# EasyEDA Pro project F405飞控工程文件（20250418）.epro, board 扩展30.5
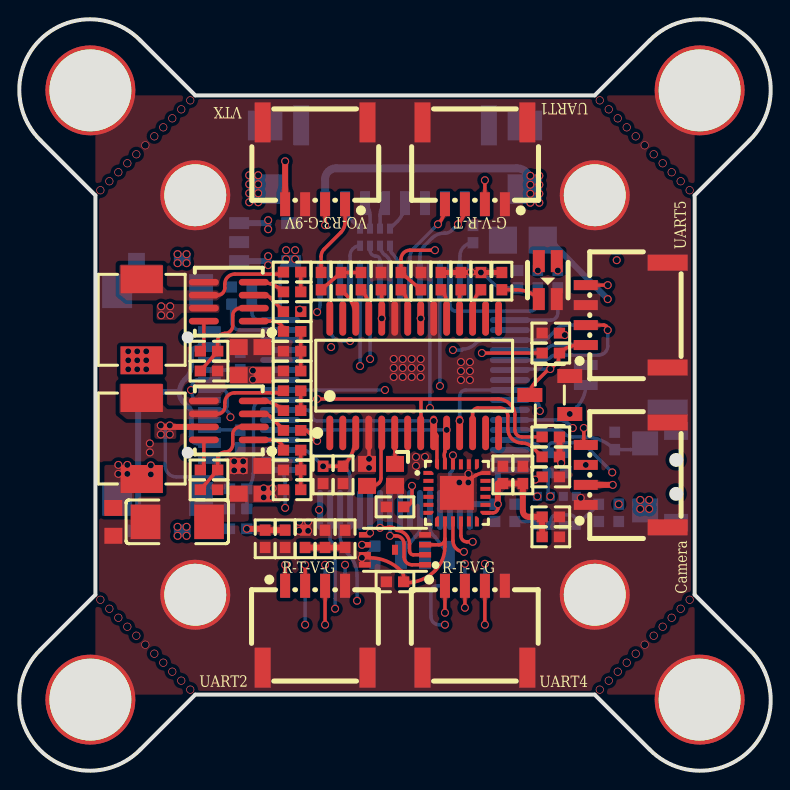
[diagram p5: board, top side]
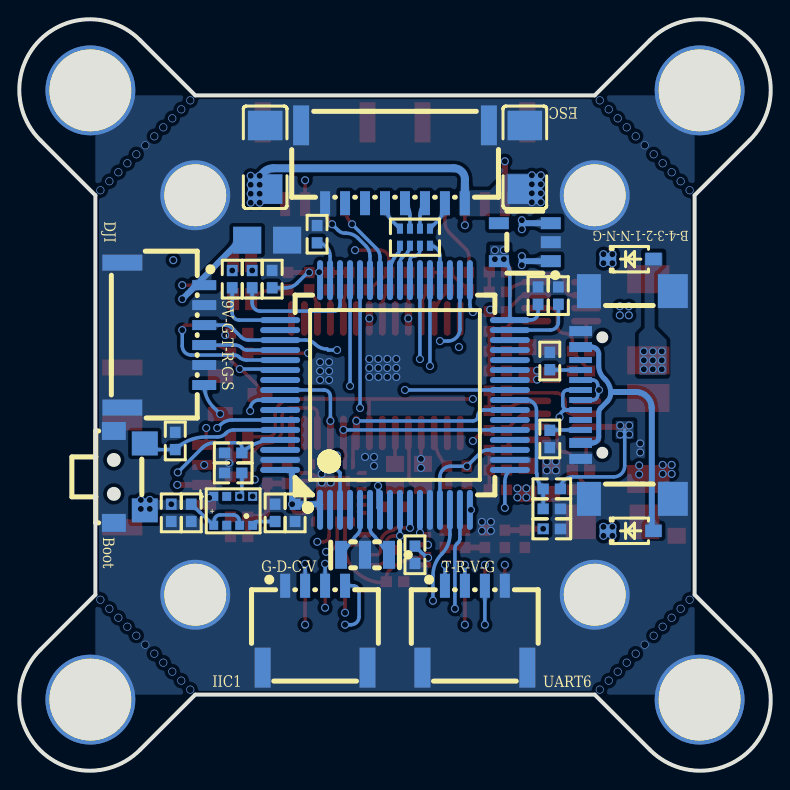
[diagram p6: board, bottom side, seen from below]

Outline 37.62 x 37.62 mm; copper layers: Top Layer, Inner1, Inner2, Bottom Layer. Coordinates in mm from the lower left corner of the outline.
Outline path: 1.06,31.56 arc(1.04,36.59) 6.06,36.56 8.81,33.81 28.81,33.81 31.56,36.56 arc(36.59,36.59) 36.56,31.56 33.81,28.82 33.81,8.81 36.56,6.06 arc(36.59,1.04) 31.56,1.06 28.81,3.81 8.81,3.81 6.06,1.06 arc(1.04,1.04) 1.06,6.06 3.81,8.81 3.81,28.81 1.06,31.56
Stack: Top Layer 0.035mm 外层铜厚1oz / Dielectric1 0.2104mm 7628 RC49% 8.6mil / Inner1 0.0152mm 内层铜厚 / Dielectric2 1.065mm 1.1mm H/HOZ Copper / Inner2 0.0152mm 内层铜厚 / Dielectric3 0.2104mm 7628 RC49% 8.6mil / Bottom Layer 0.035mm 外层铜厚1oz

## Design rules (mm)
template: 自定义配置
spacing copperThickness1oz (default): track to track 0.102, other pairs 0 to 0.3
spacing copperThickness2oz: track to track 0.203, other pairs 0.152 to 0.3
track width copperThickness1oz (default): min 0.127, default 0.175, max 2.54
track width copperThickness2oz: min 0.203, default 0.254, max 2.54
differential pair differentialPair (default): width min 0.127, default 0.254, max 2.54; gap min 0.152, default 0.152
via viaSize (default): diameter min 0.4, default 0.4, max 10; hole min 0.3, default 0.3, max 6.3

## Placement (name value [footprint] x y rotation side)
C1  100nF  [R0402]  24.96 24.61 90 bottom
C2  100nF  [R0402]  23.81 12.91 270 bottom
C3  100nF  [R0402]  11.65 23.79 90 bottom
C4  100nF  [R0402]  17.81 10.81 270 bottom
C5  100nF  [R0402]  25.21 14.81 90 top
C6  1uF  [R0402]  24.21 14.81 90 top
C7  100nF  [R0402]  26.61 21.91 0 top
C8  2.2uF  [R0402]  10.96 12.11 0 bottom
C11  100nF  [R0402]  18.81 13.21 180 top
C12  100nF  [C0402]  9.5 20.02 180 top
C13  100nF  [C0402]  9.5 14.07 180 top
C14  22uF  [C0603]  12.18 20.51 270 top
C15  22uF  [C0603]  10.99 20.51 270 top
C16  22uF  [C0603]  10.99 14.57 270 top
C18  47uF  [C1206]  25.31 30.71 270 bottom
C19  47uF  [C1206]  12.31 30.71 270 bottom
C20  100nF  [C0402]  13.66 23.98 0 top
C21  100nF  [C0402]  13.66 18.03 0 top
C22  2.2uF  [R0402]  10.64 23.79 90 bottom
C23  2.2uF  [R0402]  22.71 26.86 90 bottom
C25  47uF  [C1206]  7.91 12.46 0 top
C26  100nF  [C0402]  30.01 12.91 90 bottom
C27  100nF  [C0402]  29.01 12.91 90 bottom
C29  100nF  [C0402]  26.61 14.71 180 top
C30  4.7uF  [C0603]  4.71 12.46 270 top
C32  100nF  [C0402]  18.11 24.51 90 top
C33  100nF  [C0402]  15.21 14.81 270 top
C34  100nF  [C0402]  16.21 14.81 270 top
C35  22uF  [C0805]  25.21 26.56 0 bottom
C36  100nF  [C0402]  15.31 11.61 270 top
C37  10nF  [C0402]  16.31 11.61 270 top
C38  22uF  [C0402]  16.11 24.51 90 top
C39  22uF  [C0402]  17.11 24.51 90 top
C41  100nF  [C0402]  19.11 24.51 90 top
C42  22uF  [C0603]  12.18 14.57 270 top
C43  100nF  [R0402]  18.81 9.46 180 top
C44  100nF  [R0402]  12.31 11.61 270 top
C45  100nF  [R0402]  14.31 11.61 90 top
C46  100nF  [R0402]  13.31 11.61 270 top
C47  100nF  [R0402]  26.61 12.71 0 top
C48  100nF  [R0402]  26.61 11.71 0 top
CN1  HDGC1002WR-S-4P  [CONN-SMD_4P-P1.00_HDGC_HDGC1002WR-S-4P]  22.81 30.41 180 top
CN2  HDGC1002WR-S-4P  [CONN-SMD_4P-P1.00_HDGC_HDGC1002WR-S-4P]  14.81 30.41 180 top
CN3  HDGC1002WR-S-4P  [CONN-SMD_4P-P1.00_HDGC_HDGC1002WR-S-4P]  14.81 7.21 0 top
CN4  HDGC1002WR-S-4P  [CONN-SMD_4P-P1.00_HDGC_HDGC1002WR-S-4P]  30.41 14.81 90 top
CN6  HDGC1002WR-S-4P  [CONN-SMD_4P-P1.00_HDGC_HDGC1002WR-S-4P]  22.81 7.21 0 top
CN7  HDGC1002WR-S-4P  [CONN-SMD_4P-P1.00_HDGC_HDGC1002WR-S-4P]  30.41 22.81 90 top
CN8  HDGC1002WR-S-4P  [CONN-SMD_4P-P1.00_HDGC_HDGC1002WR-S-4P]  22.81 7.21 180 bottom
CN9  HDGC1002WR-S-6P  [CONN-SMD_6P-P1.00_HDGC1002WR-S-6P]  30.41 21.81 270 bottom
CN10  HDGC1002WR-S-4P  [CONN-SMD_4P-P1.00_HDGC_HDGC1002WR-S-4P]  14.81 7.21 180 bottom
D1  BAT60B  [SOD-323_L1.7-W1.3-LS2.6-RD-1]  7.01 25.61 180 bottom
D2  BAT60B  [SOD-323_L1.7-W1.3-LS2.6-RD-1]  7.01 12.01 180 bottom
L1  10uH  [IND-SMD_L4.4-W4.2]  6.13 22.58 90 top
L2  10uH  [IND-SMD_L4.4-W4.2]  6.13 16.64 90 top
LED1  TJ-S1615CY6TGLCCSRGB-A5  [LED-ARRAY-SMD_4P-L1.6-W1.5-BL-FD]  26.46 24.56 90 top
NOREF  -  [Pad_e2430]  34.06 3.56 0 top
NOREF#2  -  [Pad_e186]  28.81 8.81 0 top
NOREF#3  -  [Pad_e2431]  3.56 3.56 0 top
NOREF#4  -  [Pad_e2428]  3.56 34.06 0 top
NOREF#5  -  [Pad_e2429]  34.06 34.06 0 top
NOREF#6  -  [Pad_e187]  8.81 8.81 0 top
NOREF#7  -  [Pad_e183]  28.81 28.81 0 top
NOREF#8  -  [Pad_e188]  8.81 28.81 0 top
Q1  SS8050_C2150  [SOT-23-3_L2.9-W1.3-P1.90-LS2.4-BR]  26.56 18.81 0 top
R1  10kΩ  [R0402]  29.81 16.51 90 bottom
R2  10kΩ  [R0402]  10.96 14.11 180 bottom
R3  1kΩ  [R0402]  10.96 13.11 0 bottom
R4  100kΩ  [R0402]  9.5 21.01 180 top
R5  100kΩ  [R0402]  9.5 15.06 180 top
R6  10kΩ  [R0402]  26.61 20.91 0 top
R7  1MΩ  [R0402]  13.66 22.99 180 top
R8  1MΩ  [R0402]  13.66 17.04 180 top
R9  20Ω  [R0402]  13.66 24.97 0 top
R10  20Ω  [R0402]  13.66 19.02 0 top
R11  1kΩ  [R0402]  25.96 24.61 90 bottom
R12  10kΩ  [R0402]  26.91 15.91 180 bottom
R13  10kΩ  [R0402]  26.91 14.91 180 bottom
R14  1kΩ  [R0402]  26.96 24.61 90 bottom
R15  1kΩ  [R0402]  24.16 24.51 270 top
R16  51kΩ  [R0402]  13.66 22 0 top
R17  41.2kΩ  [R0402]  13.66 20.02 180 top
R18  51kΩ  [R0402]  13.66 16.05 0 top
R19  41.2kΩ  [R0402]  13.66 14.07 180 top
R20  7.68kΩ  [R0402]  13.66 21.01 0 top
R21  4.02kΩ  [R0402]  13.66 15.06 0 top
R22  100kΩ  [R0402]  24.81 12.91 270 bottom
R23  5.1kΩ  [R0402]  11.06 20.51 270 bottom
R24  5.1kΩ  [R0402]  11.06 16.61 90 bottom
R25  1k  [R0402]  26.61 15.71 0 top
R26  1k  [R0402]  22.11 24.51 90 top
R27  1k  [R0402]  23.11 24.51 90 top
R28  10k  [R0402]  21.11 24.51 90 top
R29  10k  [R0402]  26.61 16.71 0 top
R30  75  [R0402]  15.11 24.51 90 top
R34  75  [R0402]  20.11 24.51 90 top
RN2  47Ω  [RES-ARRAY-SMD_0402-8P-L2.0-W1.0-BL]  17.81 26.71 180 bottom
SW1  TS24CA  [SW-SMD_TS24CA]  32.11 14.71 90 bottom
U1  ME6217C33M5G  [SOT-23-5_L3.0-W1.7-P0.95-LS2.8-BR]  12.31 26.46 180 bottom
U2  MP9943GQ-Z  [QFN-8_L3.0-W3.0-P0.65-BL]  10.49 23.49 90 top
U3  MP9943GQ-Z  [QFN-8_L3.0-W3.0-P0.65-BL]  10.49 17.54 90 top
U4  AT7456E  [AT7456E-SHORTER-FOOTPRINT]  19.77 19.78 0 top
U5  MPU6500  [QFN-24_L3.0-W3.0-P0.40-BL-EP]  21.91 13.91 270 top
U6  SPL06-001  [SENSOR-SMD_SPL06-001]  26.91 13.01 0 bottom
U8  HDGC1002WR-S-8P  [CONN-SMD_8P-P1.00_HDGC_HDGC1002WR-S-8P]  18.81 30.37 0 bottom
U9  Crystal2016  [CRYSTAL2016]  18.11 14.81 0 top
U10  STM32F405RGT6  [LQFP-64_L10.0-W10.0-P0.50-LS12.0-BL]  18.81 18.81 180 bottom
U11  W25Q16JVUXIQ  [USON-8_L3.0-W2.0-P0.50-BL-EP]  18.81 11.06 90 top
USB1  TYPE-C 16P QTWT  [USB-TYPE-C-SMD_TYPE-C-16P-QTWT]  7.21 18.81 90 bottom
X1  8MHz  [OSC-SMD_3P-L3.2-W1.3-P1.20-L]  20.31 10.81 0 bottom

## Footprints (pads in the part's own frame, mm; a bottom-side part is the same pattern mirrored in y, then rotated)
AT7456E-SHORTER-FOOTPRINT
  oval 0.343x1.732 smd: 1(-4.225,-2.866) 2(-3.575,-2.866) 3(-2.925,-2.866) 4(-2.275,-2.866) 5(-1.625,-2.866) 6(-0.975,-2.866) 7(-0.325,-2.866) 8(0.325,-2.866) 9(0.975,-2.866) 10(1.625,-2.866) 11(2.275,-2.866) 12(2.925,-2.866) 13(3.575,-2.866) 14(4.225,-2.866) 15(4.225,2.865) 16(3.575,2.865) 17(2.925,2.865) 18(2.275,2.865) 19(1.625,2.865) 20(0.975,2.865) 21(0.325,2.865) 22(-0.325,2.865) 23(-0.975,2.865) 24(-1.625,2.865) 25(-2.275,2.865) 26(-2.925,2.865) 27(-3.575,2.865) 28(-4.225,2.865)
C0402
  rect 0.567x0.54 smd: 1(-0.432,0) 2(0.432,0)
C0603
  rect 0.8x0.9 smd: 1(-0.7,0) 2(0.7,0)
C0805
  rect 1.41x1.35 smd: 1(-1,0) 2(1,0)
C1206
  rect 1.485x1.728 smd: 1(-1.593,0) 2(1.593,0)
CONN-SMD_4P-P1.00_HDGC_HDGC1002WR-S-4P
  rect 0.5x1.2 smd: 1(-1.5,2.05) 2(-0.5,2.05) 3(0.5,2.05) 4(1.5,2.05)
  rect 0.8x2 smd: 5(2.625,-2.05) 6(-2.625,-2.05)
CONN-SMD_6P-P1.00_HDGC1002WR-S-6P
  rect 0.5x1.2 smd: 1(-2.5,2.05) 2(-1.5,2.05) 3(-0.5,2.05) 4(0.5,2.05) 5(1.5,2.05) 6(2.5,2.05)
  rect 0.8x2 smd: 7(3.625,-2.05) 8(-3.625,-2.05)
CONN-SMD_8P-P1.00_HDGC_HDGC1002WR-S-8P
  rect 0.5x1.2 smd: 1(-3.5,1.95) 2(-2.5,1.95) 3(-1.5,1.95) 4(-0.5,1.95) 5(0.5,1.95) 6(1.5,1.95) 7(2.5,1.95) 8(3.5,1.95)
  rect 0.8x2 smd: 9(4.7,-1.95) 10(-4.7,-1.95)
CRYSTAL2016
  custom 0.9x0.8 smd: 1(0.7,0.55) 2(-0.7,0.55) 3(-0.7,-0.55) 4(0.7,-0.55)
IND-SMD_L4.4-W4.2
  rect 1.4x2.12 smd: 1(2.028,0) 2(-2.028,0)
LED-ARRAY-SMD_4P-L1.6-W1.5-BL-FD
  rect 1.1x0.6 smd: 1(-0.95,-0.45) 2(0.95,-0.45) 3(0.95,0.45) 4(-0.95,0.45)
LQFP-64_L10.0-W10.0-P0.50-LS12.0-BL
  oval 0.3x2 smd: 1(-3.75,-5.75) 2(-3.25,-5.75) 3(-2.75,-5.75) 4(-2.25,-5.75) 5(-1.75,-5.75) 6(-1.25,-5.75) 7(-0.75,-5.75) 8(-0.25,-5.75) 9(0.25,-5.75) 10(0.75,-5.75) 11(1.25,-5.75) 12(1.75,-5.75) 13(2.25,-5.75) 14(2.75,-5.75) 15(3.25,-5.75) 16(3.75,-5.75) 33(3.75,5.75) 34(3.25,5.75) 35(2.75,5.75) 36(2.25,5.75) 37(1.75,5.75) 38(1.25,5.75) 39(0.75,5.75) 40(0.25,5.75) 41(-0.25,5.75) 42(-0.75,5.75) 43(-1.25,5.75) 44(-1.75,5.75) 45(-2.25,5.75) 46(-2.75,5.75) 47(-3.25,5.75) 48(-3.75,5.75)
  oval 2x0.3 smd: 17(5.75,-3.75) 18(5.75,-3.25) 19(5.75,-2.75) 20(5.75,-2.25) 21(5.75,-1.75) 22(5.75,-1.25) 23(5.75,-0.75) 24(5.75,-0.25) 25(5.75,0.25) 26(5.75,0.75) 27(5.75,1.25) 28(5.75,1.75) 29(5.75,2.25) 30(5.75,2.75) 31(5.75,3.25) 32(5.75,3.75) 49(-5.75,3.75) 50(-5.75,3.25) 51(-5.75,2.75) 52(-5.75,2.25) 53(-5.75,1.75) 54(-5.75,1.25) 55(-5.75,0.75) 56(-5.75,0.25) 57(-5.75,-0.25) 58(-5.75,-0.75) 59(-5.75,-1.25) 60(-5.75,-1.75) 61(-5.75,-2.25) 62(-5.75,-2.75) 63(-5.75,-3.25) 64(-5.75,-3.75)
OSC-SMD_3P-L3.2-W1.3-P1.20-L
  rect 0.6x1.4 smd: 1(-1.199,0) 2(0,0) 3(1.199,0)
Pad_e183
  round 3.5 hole 3.1: 1(0,0)
Pad_e186
  round 3.5 hole 3.1: 1(0,0)
Pad_e187
  round 3.5 hole 3.1: 1(0,0)
Pad_e188
  round 3.5 hole 3.1: 1(0,0)
Pad_e2428
  round 4.5 hole 4.1: 1(0,0)
Pad_e2429
  round 4.5 hole 4.1: 1(0,0)
Pad_e2430
  round 4.5 hole 4.1: 1(0,0)
Pad_e2431
  round 4.5 hole 4.1: 1(0,0)
QFN-8_L3.0-W3.0-P0.65-BL
  oval 0.33x1.5 smd: 1(-0.975,-1.25) 2(-0.325,-1.25) 3(0.325,-1.25) 4(0.975,-1.25) 5(0.975,1.25) 6(0.325,1.25) 7(-0.325,1.25) 8(-0.975,1.25)
QFN-24_L3.0-W3.0-P0.40-BL-EP
  custom 0.2x0.506 smd: 1(-1,-1.427) 6(1,-1.427) 13(1,1.427) 18(-1,1.427)
  rect 0.2x0.505 smd: 2(-0.6,-1.427) 3(-0.2,-1.427) 4(0.2,-1.427) 5(0.6,-1.427) 14(0.6,1.427) 15(0.2,1.427) 16(-0.2,1.427) 17(-0.6,1.427)
  custom 0.506x0.2 smd: 7(1.427,-1) 12(1.427,1) 19(-1.427,1) 24(-1.427,-1)
  rect 0.505x0.2 smd: 8(1.427,-0.6) 9(1.427,-0.2) 10(1.427,0.2) 11(1.427,0.6) 20(-1.427,0.6) 21(-1.427,0.2) 22(-1.427,-0.2) 23(-1.427,-0.6)
  rect 1.7x1.7 smd: 25(0,0)
R0402
  rect 0.566x0.54 smd: 1(-0.433,0) 2(0.433,0)
RES-ARRAY-SMD_0402-8P-L2.0-W1.0-BL
  rect 0.3x0.505 smd: 1(-0.75,0.427) 2(-0.25,0.427) 3(0.25,0.427) 4(0.75,0.427) 5(0.75,-0.427) 6(0.25,-0.427) 7(-0.25,-0.427) 8(-0.75,-0.427)
SENSOR-SMD_SPL06-001
  rect 0.45x0.45 smd: 1(0.975,-0.725) 2(0.325,-0.725) 3(-0.325,-0.725) 4(-0.975,-0.725) 5(-0.975,0.725) 6(-0.325,0.725) 7(0.325,0.725) 8(0.975,0.725)
SOD-323_L1.7-W1.3-LS2.6-RD-1
  rect 0.83x0.63 smd: 1(-1.14,0) 2(1.14,0)
SOT-23-3_L2.9-W1.3-P1.90-LS2.4-BR
  rect 1.25x0.7 smd: 1(1,-0.95) 2(1,0.95) 3(-1,0)
SOT-23-5_L3.0-W1.7-P0.95-LS2.8-BR
  rect 1x0.6 smd: 1(1.3,-0.95) 2(1.3,0) 3(1.3,0.95) 4(-1.3,0.95) 5(-1.3,-0.95)
SW-SMD_TS24CA
  rect 0.9x1.2 smd: 1(-2.3,0.775) 2(2.3,0.775)
  rect 1.2x1.3 smd: 3(-1.675,-0.775) 4(1.675,-0.775)
USB-TYPE-C-SMD_TYPE-C-16P-QTWT
  rect 1.7x1.5 smd: 0(-5.2,-2.309) 0(5.2,-2.309)
  rect 1.7x1.2 smd: 0(-5.2,1.891) 0(5.2,1.891)
  rect 0.5x1.14 smd: A1(-3.2,2.308) A4(-2.4,2.308) A9(2.4,2.308) A12(3.2,2.308)
  rect 0.3x1.14 smd: A5(-1.25,2.308) A6(-0.25,2.308) A7(0.25,2.308) A8(1.25,2.309) B5(1.75,2.308) B6(0.75,2.308) B7(-0.75,2.308) B8(-1.75,2.309)
USON-8_L3.0-W2.0-P0.50-BL-EP
  rect 0.28x0.6 smd: 1(-0.75,-1.508) 2(-0.25,-1.508) 3(0.25,-1.508) 4(0.75,-1.508) 5(0.75,1.508) 6(0.25,1.508) 7(-0.25,1.508) 8(-0.75,1.508)
  rect 0.5x0.3 smd: 9(0,0)

## Nets
As in the schematic, except:
GND: C1.2 C2.2 C3.2 C4.2 C5.2 C6.2 C7.1 C8.1 C11.2 C12.1 C13.1 C14.1 C15.1 C16.1 C18.1 C19.1 C22.2 C23.2 C25.1 C26.1 C27.1 C29.1 C30.2 C32.2 C33.2 C34.2 C35.1 C36.1 C37.1 C42.1 C43.2 C44.2 C45.2 C46.2 C47.2 C48.2 CN1.1 CN1.5 CN1.6 CN2.3 CN2.5 CN2.6 CN3.4 CN3.5 CN3.6 CN4.1 CN4.5 CN4.6 CN6.4 CN6.5 CN6.6 CN7.3 CN7.5 CN7.6 CN8.1 CN8.5 CN8.6 CN9.2 CN9.5 CN9.7 CN9.8 CN10.4 CN10.5 CN10.6 LED1.1 NOREF.1 NOREF#2.1 NOREF#3.1 NOREF#4.1 NOREF#5.1 NOREF#6.1 NOREF#7.1 NOREF#8.1 Q1.2 R1.2 R3.1 R20.1 R21.1 R22.1 R23.1 R24.1 R34.2 SW1.1 SW1.2 U1.2 U2.5 U3.5 U4.4 U4.20 U4.23 U5.18 U5.20 U5.25 U6.1 U6.7 U8.8 U8.9 U8.10 U9.2 U9.4 U10.12 U10.18 U10.63 U11.4 USB1.0 USB1.A1 USB1.A12 X1.2

Pads without a net: U1 4; U4 1 2 7 13 14 15 16 27 28; U5 1 2 3 4 5 6 7 11 14 15 16 17 19 21; U6 2; U8 6 7; U10 2 4 8 28; U11 9; USB1 A5 B5

## Via types
v1: diameter 0.4, hole 0.35, Top Layer to Bottom Layer, 44 vias
v2: diameter 0.4, hole 0.3, Top Layer to Bottom Layer, 178 vias

## Routing (per net, layer and track width the routed paths; a pad name or vN(x,y) marks a point on that pad's centre or on a via; arc(x,y) is an arc through that point)
4V5: length 16.9
  Top Layer w0.175: CN7.4 v2(29.46,24.31) ; CN6.3 v2(23.31,7.31) ; CN1.2 v2(23.31,29.56) ; CN3.3 v2(15.31,7.31)
  Top Layer w0.3: v2(11.4,12.11) 12.05,12.11 arc(12.14,12.1) 12.21,12.05 13.21,12.05
  Bottom Layer w0.175: v2(21.31,7.31) 21.01,7.31 arc(20.73,7.43) 20.61,7.71 20.61,8.96 arc(20.7,9.18) 20.91,9.26 CN8.4 ; CN10.3 v2(14.31,7.31)
  Bottom Layer w0.3: 12.46,27.35 v2(12.46,27.11) ; 12.46,27.35 v2(12.46,27.56) ; 12.46,27.35 arc(12.39,27.4) 12.3,27.41 U1.3 ; v2(12.46,25.76) 12.46,25.54 ; 12.46,25.54 v2(12.46,25.31) ; 12.46,25.54 arc(12.44,25.52) 12.4,25.51 U1.1
  vias: v2(7.93,25.86) v2(7.93,25.41) v2(7.93,12.21) v2(7.93,11.76) v2(8.38,25.86) v2(8.38,25.41) v2(8.38,12.21) v2(8.38,11.76) v2(27.31,21.81)
5V_BEC: length 6.8
  Inner1 w0.5: v2(5.46,20.55) v2(5.91,20.55) v2(6.36,20.55) 10.74,20.55 arc(11.26,20.4) 11.61,19.99 arc(11.68,19.79) v2(11.7,19.59)
  vias: v2(5.46,21) v2(5.46,20.1) v2(5.91,21) v2(5.91,20.1) v2(6.36,21) v2(6.36,20.1) v2(11.7,20.04)
5V_USB: length 15.4
  Bottom Layer w0.25: USB1.A9 8.96,21.21 arc(8.72,21.11) 8.61,20.86 8.61,20.27 arc(8.55,19.94) 8.36,19.66 8.3,19.6 arc(8.09,19.28) 8.01,18.91 arc(8.06,18.68) 8.19,18.49 8.51,18.16 arc(8.59,18.05) 8.61,17.92 8.61,16.71 arc(8.7,16.5) 8.91,16.41 USB1.A4
  Bottom Layer w0.3: 7.96,18.96 6.76,18.96 arc(6.2,18.73) 5.96,18.16 5.96,18.16 5.96,12.11 5.96,12.1 arc(5.94,12.04) D2.2
9V_BEC: length 87.3
  Top Layer w0.3: v2(29.71,14.31) CN4.2 ; v2(13.31,30.51) CN2.4
  Inner1 w0.3: 12.46,13.76 9.46,13.76 arc(8.68,13.92) 8.01,14.37 7.61,14.76 arc(7.39,14.91) 7.13,14.96 5.41,14.96 ; 12.46,13.76 12.46,13.91 ; 12.46,13.76 12.63,13.76 arc(12.66,13.77) 12.69,13.79 ; 12.46,13.76 12.46,10.51 arc(12.71,9.91) 13.31,9.66 24.91,9.66 arc(25.88,9.86) 26.71,10.41 28.02,11.72 arc(28.84,12.27) 29.82,12.46 31.46,12.46 arc(31.92,12.66) 32.11,13.11 32.11,13.76 ; 32.11,13.76 32.11,19.91 arc(31.92,20.88) 31.37,21.71 v2(29.46,23.61) ; 32.11,13.76 arc(31.95,14.15) 31.56,14.31 v2(29.71,14.31) ; v2(13.31,30.51) 13.31,27.45 arc(13.26,27.19) 13.11,26.96 arc(12.56,26.59) 11.91,26.46 5.36,26.46 arc(4.62,26.16) 4.31,25.41 4.31,15.91 arc(4.56,15.31) 5.16,15.06 ; 5.41,15.16 6.98,15.16 arc(7.57,15.05) 8.06,14.71 8.36,14.42 arc(8.86,14.08) 9.46,13.96 12.63,13.96 arc(12.66,13.97) 12.69,13.99 ; v2(4.96,15.31) v2(5.41,15.31) ; v2(4.96,14.86) v2(5.41,14.86)
  Bottom Layer w0.3: CN9.1 28.65,24.31 arc(28.76,24.29) 28.84,24.24 29.06,24.02 arc(29.11,23.96) 29.17,23.91 v2(29.46,23.61) ; 28.57,24.52 26.81,26.3 26.81,26.32 arc(26.54,26.5) C35.2
  vias: v2(6.59,15.29) v2(6.59,14.84) v2(12.24,14.14) v2(12.24,13.69) v2(12.69,14.14) v2(12.69,13.69)
GND: length 3.4
  Top Layer w0.175: U4.4 17.51,16.9 v2(17.51,15.61) ; v2(22.48,14.43) 21.96,13.91 U5.25 ; 17.5,15.57 arc(17.53,15.37) v2(17.51,15.16) ; 23.19,14.91 arc(23.02,14.87) 22.85,14.79 arc(22.64,14.65) 22.46,14.46
  vias: v1(6.31,31.31) v1(6.31,6.31) v1(31.31,31.31) v1(31.31,6.31) v2(6.54,16.39) v2(6.54,15.94) v2(10.76,15.49) v2(10.76,15.04) v2(11.21,15.49) v2(11.21,15.04) v2(14.01,12.46) v2(14.01,12.01) v2(14.46,12.46) v2(14.46,12.01) v2(18.75,20.62) v2(18.75,20.17) v2(18.75,19.72) v2(19.2,20.62) v2(19.2,20.17) v2(19.2,19.72) v2(19.65,20.62) v2(19.65,20.17) v2(19.65,19.72) v2(19.86,15.71) v2(19.86,15.26) v2(20.1,20.62) v2(20.1,20.17) v2(20.1,19.72) v2(20.31,15.71) v2(22.03,14.43) v2(22.11,20.46) v2(22.11,20.01) v2(22.11,19.56) v2(22.49,14.86) v2(22.56,20.46) v2(22.56,20.01) v2(22.56,19.56) v2(28.11,13.66)
VBAT: length 52.3
  Top Layer w0.175: v2(14.91,16.51) 14.39,17.04 R8.1
  Top Layer w0.3: v2(7.09,17.29) 7.16,17.22 9.24,17.22
  Inner2 w0.4: 7.31,17.06 14.36,17.06 v2(14.91,16.51)
  Inner2 w1: 7.31,17.21 7.31,23.01 7.39,23.09 ; v2(11.96,28.46) v2(11.96,28.91) v2(11.96,29.36) v2(11.96,29.81) v2(11.51,29.81) v2(11.51,29.36) v2(11.51,28.91) v2(11.51,28.46) 11.51,27.21 7.39,23.09 ; 7.39,23.09 v2(14.05,23.09)
  Bottom Layer w0.175: 7.31,17.06 7.31,15.26 arc(7.48,14.88) 7.86,14.71 9.93,14.71 arc(10.36,14.54) R2.2
  Bottom Layer w0.4: U8.1 15.31,29.61 arc(15.48,30) 15.86,30.16 24.91,30.16 arc(25.28,30.06) 25.53,29.76 arc(25.58,29.63) 25.59,29.49 v2(25.59,28.89)
  vias: v2(7.11,23.26) v2(7.11,22.81) v2(7.09,16.84) v2(7.56,23.26) v2(7.56,22.81) v2(7.54,17.29) v2(7.54,16.84) v2(25.59,29.79) v2(25.59,29.34) v2(25.59,28.44) v2(26.04,29.79) v2(26.04,29.34) v2(26.04,28.89) v2(26.04,28.44)
VDD_MCU: length 105.1
  Top Layer w0.175: v2(23.96,13.35) 23.96,13.16 arc(23.89,12.99) 23.71,12.91 U5.13 ; C43.1 19.25,9.69 arc(19.21,9.87) 19.11,10.01 arc(18.39,10.5) 17.55,10.66 v2(17.16,10.66) 17.16,10.46 U11.8 ; v2(15.21,15.25) C34.1 arc(16.68,15.95) 16.85,16.78 U4.3 ; U11.3 21.01,11.31 arc(21.23,11.4) 21.31,11.61 ; v2(18.15,22.65) 18.15,24 arc(18.14,24.04) C32.1 ; 21.31,11.61 U5.8 ; 21.31,11.61 21.31,11.22 arc(21.18,10.57) 20.81,10.01 arc(20.15,9.57) 19.37,9.41 19.25,9.41 ; R6.1 v2(23.16,20.91)
  Top Layer w0.25: 21.11,24.95 v2(23.11,24.95) 24.16,24.95
  Top Layer w0.3: C48.1 C47.1 25.51,12.71 arc(25.3,12.8) 25.21,13.01 C5.1 23.96,14.38 v2(23.96,13.35) ; 14.32,11.18 C36.2 C37.2 ; R29.2 R25.2
  Inner1 w0.175: v2(18.15,22.65) v2(20.1,22.65) 20.1,24.86 arc(20.13,24.93) 20.21,24.96 ; v2(23.16,20.91) 24.9,20.91 arc(24.94,20.92) 24.96,20.94 ; v2(23.96,13.35) 25.26,13.35 ; v2(27.13,15.41) 27.13,13.06
  Inner1 w0.4: 31.31,13.06 27.13,13.06
  Inner1 w0.5: v2(13.36,26.06) 13.76,25.67 arc(14.54,25.15) 15.47,24.96 v2(22.61,24.96) 24.16,24.96 arc(24.73,24.73) 24.96,24.16 24.96,16.91 ; 24.96,16.91 24.96,14.06 arc(25.26,13.36) 25.96,13.06 27.13,13.06 ; 24.96,16.91 arc(24.82,16.56) 24.46,16.41 16.38,16.41 arc(15.56,16.07) v2(15.21,15.25) 15.21,15 arc(15.33,14.41) 15.66,13.91 arc(15.96,13.47) 16.06,12.95 16.06,11.91 arc(16.16,11.45) 16.42,11.06 16.57,10.91 arc(16.84,10.73) v2(17.16,10.66)
  Bottom Layer w0.175: U10.19 14.16,16.06 arc(14.38,16.02) 14.56,15.9 v2(15.21,15.25) 16.03,15.25 arc(16.41,15.09) 16.56,14.71 U10.13 ; 24.96,24.18 24.28,24.18 arc(23.97,24.24) 23.71,24.41 23.23,24.9 arc(23.18,24.94) v2(23.11,24.95) ; 11.65,23.36 11.65,22.93 arc(11.76,22.68) 12.01,22.57 13.06,22.57 arc(13.06,22.57) U10.32 13.06,24.89 arc(13.14,25.28) v2(13.36,25.61) ; U6.8 28.56,12.92 arc(28.58,12.94) 28.6,12.96 C27.2 ; C4.1 17.45,10.89 arc(17.38,10.83) 17.32,10.76 17.28,10.72 arc(17.23,10.68) v2(17.16,10.66) ; 26.61,12.51 arc(26.7,12.73) 26.91,12.81 27.56,12.81 arc(27.78,12.73) 27.86,12.51
  Bottom Layer w0.3: U10.64 23.96,15.06 v2(23.96,13.35) 22.56,13.35 U10.1
  vias: v2(13.81,26.06) v2(13.81,25.61) v2(30.01,13.35) v2(31.09,13.56) v2(31.09,13.11) v2(31.54,13.56) v2(31.54,13.11)
(no net):
  vias: v1(4.06,29.06) v1(4.06,8.56) v1(4.51,29.51) v1(4.51,8.11) v1(4.96,29.96) v1(4.96,7.66) v1(5.41,30.41) v1(5.41,7.21) v1(5.86,30.86) v1(5.86,6.76) v1(6.76,31.76) v1(6.76,5.86) v1(7.21,32.21) v1(7.21,5.41) v1(7.66,32.66) v1(7.66,4.96) v1(8.11,33.11) v1(8.11,4.51) v1(8.56,33.56) v1(8.56,4.06) v1(29.06,33.56) v1(29.06,4.06) v1(29.51,33.11) v1(29.51,4.51) v1(29.96,32.66) v1(29.96,4.96) v1(30.41,32.21) v1(30.41,5.41) v1(30.86,31.76) v1(30.86,5.86) v1(31.76,30.86) v1(31.76,6.76) v1(32.21,30.41) v1(32.21,7.21) v1(32.66,29.96) v1(32.66,7.66) v1(33.11,29.51) v1(33.11,8.11) v1(33.56,29.06) v1(33.56,8.56)
BOOT: length 7.1
  Bottom Layer w0.175: U10.60 26.9,17.06 arc(27.1,17.03) 27.26,16.91 27.3,16.88 arc(27.48,16.76) 27.7,16.71 28.29,16.71 arc(29.11,16.55) R1.1 30.6,16.08 arc(31,16.16) SW1.4
CAM: length 24
  Top Layer w0.175: v2(20.81,26.06) 19.56,26.06 arc(19.25,25.93) 19.11,25.61 C41.2 R34.1 ; v2(28.27,17.16) 28.27,16.41 CN4.4
  Inner1 w0.175: v2(20.81,26.06) 29.41,26.06 arc(29.77,25.92) v2(29.91,25.56)
  Inner2 w0.175: v2(28.27,17.16) 29.36,17.16 arc(29.75,17.33) 29.91,17.71 v2(29.91,25.56)
FB_5V: length 1.8
  Top Layer w0.175: U2.1 12.72,22.51 arc(13.08,22.36) R16.1
FB_9V: length 1.8
  Top Layer w0.175: U3.1 12.72,16.57 arc(13.08,16.42) R18.1
I2C1_SCL: length 19.9
  Inner1 w0.175: v2(25.94,13.74) arc(26.17,14.08) 26.26,14.47 arc(26.28,14.58) 26.26,14.68 26.26,15.46 arc(26.38,15.75) 26.66,15.86 27.36,15.86 arc(27.65,15.75) 27.76,15.46 27.76,15.26 arc(27.9,14.95) 28.21,14.81 29.56,14.81 arc(29.65,14.85) v2(29.69,14.94)
  Inner2 w0.175: v2(22.31,10.36) 22.34,10.39 arc(22.81,10.7) 23.36,10.81 25.31,10.81 arc(25.6,10.93) 25.71,11.21 25.71,13.2 arc(25.77,13.49) v2(25.94,13.74)
  Bottom Layer w0.175: v2(29.69,14.94) 28.46,16.16 arc(28.18,16.36) 27.84,16.42 26.71,16.42 arc(26.55,16.36) 26.48,16.19 R12.2 arc(25.76,16.4) 24.91,16.56 U10.61 ; CN8.3 v2(22.31,10.36)
I2C1_SDA: length 16.2
  Inner2 w0.175: v2(27.71,17.16) 27.71,14.01 arc(27.63,13.8) 27.41,13.71 26.61,13.71 arc(26.6,13.72) v2(26.59,13.74) 26.38,13.53 arc(26.15,13.18) 26.06,12.76 26.06,10.66 arc(25.98,10.45) 25.76,10.36 v2(23.31,10.36)
  Bottom Layer w0.175: U10.59 26.96,17.56 arc(27.29,17.5) 27.56,17.32 v2(27.71,17.16) ; R13.2 26.48,13.85 arc(26.51,13.77) v2(26.59,13.74) ; CN8.2 v2(23.31,10.36)
LC_5V: length 4.7
  Top Layer w0.175: U2.6 9.93,23.81 arc(10.19,23.92) 10.3,24.17 10.3,24.37 arc(10.44,24.72) 10.79,24.87 12.99,24.87 arc(13.12,24.89) R9.1
LC_9V: length 4.7
  Top Layer w0.175: 9.24,17.87 9.93,17.87 arc(10.19,17.97) 10.3,18.23 10.3,18.43 arc(10.44,18.78) 10.79,18.92 12.99,18.92 arc(13.12,18.95) R10.1
LED1: length 6.8
  Bottom Layer w0.175: 25.96,24.18 25.96,23.41 arc(25.85,23.13) 25.56,23.01 21.86,23.01 arc(21.65,23.1) 21.56,23.31 U10.46
LED2: length 3.9
  Bottom Layer w0.175: 26.96,24.18 26.96,22.91 arc(26.86,22.67) 26.61,22.56 U10.49
MCU_OSCI: length 2.6
  Bottom Layer w0.175: X1.3 20.81,11.71 20.69,11.84 arc(20.6,11.98) 20.56,12.14 U10.5
MCU_OSCO: length 2.6
  Bottom Layer w0.175: U10.6 20.06,12.14 arc(20.03,11.98) 19.94,11.84 19.81,11.71 X1.1
NRST: length 2.5
  Top Layer w0.175: v2(19.66,14.26) 19.66,13.63 arc(19.54,13.34) C11.1
  Bottom Layer w0.175: v2(19.66,14.26) 19.66,13.16 U10.7
OSD_HSYNC: length 1.5
  Top Layer w0.175: 22.05,22.65 22.05,23.93 arc(22.07,24.01) R26.1
OSD_LOS: length 6.2
  Top Layer w0.175: R25.1 25.71,16.19 arc(25.46,16.36) 25.16,16.41 arc(24.67,16.62) 24.46,17.11 24.46,17.76 arc(24.35,18.05) 24.06,18.16 22.96,18.16 arc(22.78,18.09) 22.7,17.9 22.7,16.92
OSD_OSCI: length 3.2
  Top Layer w0.175: U9.3 17.65,14.26 arc(17.85,14.3) 18.01,14.41 arc(18.09,14.53) 18.11,14.66 18.11,16.83 arc(18.12,16.88) U4.5
OSD_OSCO: length 1.6
  Top Layer w0.175: U9.1 18.81,16.88 arc(18.81,16.9) U4.6
OSD_RST: length 1.5
  Top Layer w0.175: 21.4,22.65 21.4,23.39 arc(21.33,23.77) R28.1
OSD_SAG: length 1.5
  Top Layer w0.175: 17.5,22.65 17.5,23.15 arc(17.4,23.66) C39.1
OSD_VOUT: length 1.7
  Top Layer w0.175: C38.1 16.35,23.84 arc(16.72,23.29) 16.85,22.65
OSD_VSYNC: length 1.5
  Top Layer w0.175: 22.7,22.65 22.7,23.08 arc(22.81,23.62) R27.1
OTG_FS_DM: length 19.7
  Inner1 w0.175: v2(10.58,17.7) 19.45,17.7 arc(20.06,17.82) v2(20.56,18.16)
  Bottom Layer w0.175: 10.16,18.06 10.22,18.06 arc(10.32,18.05) 10.42,18 arc(10.42,18) 10.43,18 arc(10.54,17.87) v2(10.58,17.7) ; 10.16,18.06 USB1.B7 ; 10.16,18.06 arc(10.34,18.14) 10.41,18.31 10.41,18.81 arc(10.34,18.99) 10.16,19.06 USB1.A7 ; v2(20.56,18.16) U10.44
OTG_FS_DP: length 21
  Inner1 w0.175: v2(8.6,19.06) 8.74,18.93 arc(9.42,18.47) 10.21,18.31 11.1,18.31 arc(11.3,18.28) 11.46,18.16 arc(11.63,18.05) 11.83,18.01 18.56,18.01 arc(19.67,18.24) 20.61,18.86 20.98,19.23 arc(21.02,19.26) v2(21.06,19.26)
  Bottom Layer w0.175: USB1.A6 8.91,18.56 arc(8.74,18.64) 8.66,18.81 8.66,19.31 arc(8.74,19.49) 8.91,19.56 USB1.B6 ; U10.45 v2(21.06,19.26)
PINIO2: length 6.4
  Inner1 w0.175: v2(26.06,18.01) 26.71,18.01 arc(27,17.9) 27.11,17.61 27.11,17.11 arc(27.23,16.83) 27.51,16.71 28.01,16.71 arc(28.26,16.61) 28.36,16.36 v2(28.36,15.31)
  Bottom Layer w0.175: U10.57 25.61,18.56 arc(25.93,18.43) 26.06,18.11 v2(26.06,18.01)
PWM_1: length 1.9
  Bottom Layer w0.175: RN2.8 18.56,26.16 arc(18.59,26.03) 18.66,25.91 arc(18.77,25.8) 18.86,25.67 arc(18.91,25.6) 18.94,25.52 arc(19.03,25.24) 19.06,24.95 U10.41
PWM_2: length 1.9
  Bottom Layer w0.175: RN2.7 18.06,26.26 arc(18.1,26.1) 18.19,25.97 arc(18.25,25.87) 18.35,25.81 18.47,25.68 arc(18.54,25.58) 18.56,25.45 U10.40
PWM_3: length 2
  Bottom Layer w0.175: RN2.6 17.56,26.06 arc(17.65,25.85) 17.86,25.76 arc(18.01,25.71) 18.06,25.56 U10.39
PWM_4: length 2
  Bottom Layer w0.175: U10.36 16.56,25.79 arc(16.71,26.14) RN2.5
SBUS: length 1.7
  Bottom Layer w0.175: v2(27.56,17.86) 27.91,18.21 arc(28.25,18.71) CN9.6
SDCARD_CS: length 4.2
  Top Layer w0.175: v2(18.56,11.76) 18.86,11.76 arc(19.15,11.65) 19.26,11.36 19.26,10.71 arc(19.38,10.43) 19.66,10.31 U11.1
  Bottom Layer w0.175: v2(18.56,11.76) U10.9
SENS_CUR1: length 5.2
  Bottom Layer w0.175: U10.25 v2(18.31,19.06)
SENS_VOL: length 6.7
  Bottom Layer w0.175: U10.24 12.24,18.56 arc(11.88,18.42) 11.73,18.06 11.73,14.9 11.71,14.88 arc(11.63,14.47) R2.1 R3.2
SPI1_IMU1_CS: length 3.2
  Top Layer w0.175: U5.22 v2(21.71,15.79)
  Bottom Layer w0.175: v2(21.71,15.79) 21.71,15.11 arc(21.71,15.07) 21.68,15.03 21.56,14.91 U10.3
SPI1_MISO: length 13
  Top Layer w0.175: U5.9 21.71,11.51 arc(21.88,11.13) v2(22.26,10.96)
  Inner2 w0.175: v2(22.05,17.52) 22.05,17.28 arc(21.99,16.97) 21.81,16.71 21.49,16.39 arc(21.17,15.92) 21.06,15.36 arc(21.21,14.63) 21.63,14 21.86,13.76 arc(22.16,13.32) 22.26,12.8 v2(22.26,10.96)
  Bottom Layer w0.175: U10.56 22.36,19.06 arc(22.14,18.97) 22.05,18.75 v2(22.05,17.52)
SPI1_MOSI: length 9.7
  Top Layer w0.175: U5.24 20.91,16.75 arc(20.87,16.87) U4.9
  Bottom Layer w0.175: U10.23 14.36,18.06 arc(14.58,17.98) 14.66,17.76 arc(14.74,17.59) 14.91,17.52 v2(20.75,17.52)
SPI1_OSD_CS: length 20.3
  Top Layer w0.175: 20.11,18.58 20.11,16.93 ; 20.11,16.93 20.11,16.92 ; 20.11,16.93 arc(20.11,16.92) U4.8 ; v2(14.91,18.61) 23.96,18.61 arc(24.29,18.55) 24.56,18.37 24.61,18.31 arc(24.76,18.09) 24.81,17.83 24.81,17.06 arc(24.92,16.82) 25.16,16.71 R29.1
  Inner2 w0.175: v2(14.91,22.96) v2(14.91,18.61)
  Bottom Layer w0.175: U10.33 15.06,23.33 arc(15.03,23.13) v2(14.91,22.96)
SPI1_SCLK: length 10
  Top Layer w0.175: U5.23 21.31,15.61 arc(21.28,15.79) 21.31,15.98 21.31,16.83 arc(21.34,16.89) U4.10
  Bottom Layer w0.175: v2(21.4,17.07) 13.07,17.07 arc(13.07,17.07) U10.21
SPI2_MISO: length 3.2
  Top Layer w0.175: v2(18.06,12.16) 18.38,12.16 arc(18.67,12.19) 18.91,12.04 arc(19.36,11.83) 19.54,11.36 19.54,11.01 arc(19.6,10.87) 19.73,10.81 U11.2
SPI2_MOSI: length 1.2
  Bottom Layer w0.175: v2(17.56,11.91) U10.11
SPI2_SCLK: length 15.7
  Top Layer w0.175: U11.6 v2(17.16,11.31)
  Inner2 w0.175: v2(16.56,21.51) 17.26,21.51 17.36,21.41 arc(17.86,21.21) 18.06,20.71 18.06,20.35 arc(17.95,19.76) 17.61,19.26 17.21,18.86 arc(17.03,18.59) 16.96,18.26 16.96,11.51 v2(17.16,11.31)
  Bottom Layer w0.175: v2(16.56,21.51) 16.16,21.51 arc(15.74,21.69) 15.56,22.11 U10.34
UART1_RX: length 4.9
  Top Layer w0.175: CN1.3 22.31,28.21 arc(22.22,27.75) v2(21.96,27.36)
  Bottom Layer w0.175: U10.43 20.06,25.76 arc(20.12,26.04) 20.28,26.28 20.66,26.66 arc(20.94,26.85) 21.27,26.91 21.31,26.91 arc(21.5,26.95) 21.66,27.06 v2(21.96,27.36)
UART1_TX: length 4.4
  Top Layer w0.175: CN1.4 21.31,28.21 arc(21.22,27.75) v2(20.96,27.36)
  Bottom Layer w0.175: v2(20.96,27.36) 19.74,26.14 arc(19.61,25.95) 19.56,25.71 U10.42
UART2_RX: length 5.9
  Top Layer w0.175: CN3.1 v2(13.31,10.31)
  Inner2 w0.175: v2(13.31,10.31) v2(13.31,13.16)
  Bottom Layer w0.175: v2(13.31,13.16) 13.31,14.46 arc(13.25,14.79) U10.17
UART2_TX: length 4
  Top Layer w0.175: CN3.2 v2(14.31,10.31)
  Inner2 w0.175: v2(15.01,13.06) 15.01,12 arc(14.83,11.09) v2(14.31,10.31)
  Bottom Layer w0.175: v2(15.01,13.06) U10.16
UART3_RX: length 3.9
  Bottom Layer w0.175: CN9.4 26.83,21.31 arc(26.63,21.28) 26.46,21.16 arc(26.35,21.09) 26.22,21.06 U10.52
UART3_TX: length 20.4
  Top Layer w0.175: v2(15.31,27.31) CN2.2
  Inner1 w0.175: v2(21.71,21.06) 15.98,21.06 arc(15.78,21.1) v2(15.61,21.21)
  Inner2 w0.175: v2(15.31,27.31) 15.31,23.15 arc(15.35,22.96) 15.31,22.78 15.31,21.99 arc(15.39,21.57) v2(15.61,21.21)
  Bottom Layer w0.175: CN9.3 27.33,22.31 arc(27.13,22.28) 26.96,22.16 26.51,21.71 arc(26.35,21.6) 26.15,21.56 U10.51 23.3,21.56 arc(23.04,21.51) 22.81,21.36 arc(22.54,21.18) 22.21,21.11 22.16,21.06 v2(21.71,21.06)
UART4_RX: length 11.9
  Top Layer w0.175: CN6.1 v2(21.31,7.91)
  Inner1 w0.175: v2(21.31,7.91) 16.3,7.91 arc(16.04,7.97) v2(15.81,8.11)
  Bottom Layer w0.175: U10.15 15.56,11.62 arc(15.58,11.52) 15.64,11.44 15.71,11.36 arc(15.79,11.25) 15.81,11.12 v2(15.81,8.11)
UART4_TX: length 11.4
  Top Layer w0.175: CN6.2 v2(22.31,8.16)
  Inner1 w0.175: v2(16.91,8.51) arc(17.08,8.4) 17.28,8.36 21.83,8.36 arc(22.09,8.31) v2(22.31,8.16)
  Bottom Layer w0.175: v2(16.91,8.51) 16.91,9.78 arc(16.8,10.37) 16.46,10.86 arc(16.17,11.31) 16.06,11.83 U10.14
UART5_RX: length 6.2
  Top Layer w0.175: CN7.1 28.01,21.31 arc(27.49,21.21) R6.2 arc(27.04,20.85) 27,20.8 27,20.51 26.6,20.11 v2(26.59,20.11) 26.51,20.11 25.81,19.42 arc(25.63,19.14) Q1.3
  Bottom Layer w0.175: U10.54 24.61,20.11 v2(26.59,20.11)
UART5_TX: length 7.3
  Top Layer w0.175: v2(29.46,22.06) 29.46,22.11 arc(29.41,22.26) 29.26,22.31 CN7.2
  Bottom Layer w0.175: U10.53 26.25,20.56 arc(26.45,20.6) 26.61,20.71 arc(26.73,20.79) 26.86,20.81 29.01,20.81 arc(29.33,20.95) 29.46,21.26 v2(29.46,22.06)
UART6_RX: length 17.1
  Inner2 w0.175: 16.01,12.32 16.01,18.55 arc(16.12,19.07) 16.41,19.51 arc(16.56,19.74) 16.61,20 16.61,20.61 arc(16.75,20.93) 17.06,21.06 17.16,21.06 arc(17.45,20.92) 17.56,20.61 ; 16.01,12.31 16.01,12 arc(15.83,11.09) v2(15.31,10.31)
  Bottom Layer w0.175: v2(17.57,20.61) 17.57,24.56 U10.38 ; CN10.2 v2(15.31,10.31)
UART6_TX: length 15.5
  Inner2 w0.175: v2(17.06,20.26) 17.06,20.1 arc(16.95,19.51) 16.61,19.01 arc(16.39,18.68) 16.31,18.29 v2(16.31,10.31)
  Bottom Layer w0.175: U10.37 v2(17.06,20.26) ; CN10.1 v2(16.31,10.31)
VCAP1: length 3.5
  Bottom Layer w0.175: 10.64,23.36 10.64,22.47 arc(10.75,22.19) 11.04,22.07 13.06,22.07
VCAP2: length 2.2
  Bottom Layer w0.175: U10.47 22.06,25.77 arc(22.26,26.23) 22.71,26.42
VIDIN: length 1.5
  Top Layer w0.175: 19.45,22.65 19.45,23.27 arc(19.36,23.71) C41.1
VTX: length 3.9
  Top Layer w0.175: 15.11,24.95 15.11,25.75 arc(15.15,25.95) 15.26,26.11 16.1,26.95 arc(16.26,27.19) 16.31,27.46 CN2.1
$1N953: length 2
  Top Layer w0.175: R15.2 24.89,24.08 arc(25.5,23.96) LED1.4
$1N1962: length 2.3
  Top Layer w0.175: C39.2 C38.2 R30.1
$1N3098: length 7.2
  Top Layer w0.175: U5.10 22.11,11.76 arc(22.2,11.55) 22.41,11.46 v2(22.7,11.46)
  Inner2 w0.175: v2(22.7,11.46) 24.96,11.46 arc(25.25,11.58) 25.36,11.86 25.36,13.44 arc(25.49,14.06) v2(25.84,14.58)
$1N3690: length 1.2
  Bottom Layer w0.175: 24.81,12.48 25.75,12.48 arc(25.88,12.43) U6.5
$1N5313: length 1.6
  Top Layer w0.175: U3.8 9.24,15.24 arc(9.19,15.11) R5.2
$1N5318: length 2
  Top Layer w0.175: R18.2 R21.2 R19.1
$1N5320: length 1.8
  Top Layer w0.175: 11.74,17.87 12.25,17.87 arc(12.43,17.83) 12.57,17.74 13.21,17.1 arc(13.22,17.08) R8.2
$1N5321: length 1.6
  Top Layer w0.175: 11.74,18.52 12.06,18.52 arc(12.7,18.39) C21.1
$1N5322: length 4.8
  Top Layer w0.175: 11.74,17.22 11.06,17.22 arc(10.8,17.11) 10.69,16.85 10.69,16.35 arc(10.58,16.07) 10.3,15.95 arc(10.04,15.85) 9.94,15.59 R5.1 C13.2
$1N5325: length 1
  Top Layer w0.175: C21.2 14.1,19.02 arc(14.1,19.02) R10.2
$1N5344: length 1.6
  Top Layer w0.175: U2.8 9.24,21.18 arc(9.19,21.06) R4.2
$1N5352: length 2
  Top Layer w0.175: R17.1 R20.2 R16.2
$1N5360: length 1.8
  Top Layer w0.175: U2.3 12.25,23.81 arc(12.43,23.78) 12.57,23.68 13.21,23.05 arc(13.22,23.02) R7.2
$1N5361: length 4.8
  Top Layer w0.175: C12.2 R4.1 9.94,21.54 arc(10.04,21.79) 10.3,21.9 arc(10.58,22.01) 10.69,22.29 10.69,22.79 arc(10.8,23.05) 11.06,23.16 11.74,23.16
$1N5362: length 1.6
  Top Layer w0.175: 11.74,24.46 12.06,24.46 arc(12.7,24.34) C20.1
$1N5363: length 1
  Top Layer w0.175: C20.2 14.1,24.97 arc(14.1,24.97) R9.2
$1N5613: length 1.6
  Bottom Layer w0.175: USB1.A8 11.05,20.06 arc(11.06,20.07) R23.2
$1N5614: length 1.6
  Bottom Layer w0.175: USB1.B8 11.05,17.06 arc(11.06,17.06) R24.2
$1N20077: length 1.5
  Bottom Layer w0.175: RN2.4 16.69,27.52 arc(16.41,27.93) U8.2
$1N20079: length 1.3
  Bottom Layer w0.175: RN2.3 17.56,27.81 arc(17.5,28.14) U8.3
$1N20081: length 1.3
  Bottom Layer w0.175: RN2.2 18.06,27.81 arc(18.13,28.14) U8.4
$1N20083: length 1.5
  Bottom Layer w0.175: RN2.1 18.94,27.52 arc(19.22,27.93) U8.5
$1N22853:
  vias: v2(25.96,25.05)
$1N22855:
  vias: v2(26.96,25.05)

## Copper pours and planes (outline as drawn; the poured copper is in the pictures)
4V5 on Inner2: 3.81,3.81 33.81,3.81 33.81,33.81 3.81,33.81
5V_BEC on Top Layer: 10.51,20.26 13.51,20.26 13.51,19.36 10.51,19.36
5V_BEC on Bottom Layer: 5.21,19.81 5.21,21.56 5.81,22.16 5.81,24.91 5.41,25.31 5.41,25.96 6.31,25.96 6.31,22.16 6.61,21.86 6.61,19.81
5V_BEC on Inner1: 5.21,21.21 6.61,21.21 6.61,19.86 5.21,19.86
9V_BEC on Top Layer: 4.26,15.31 5.76,15.31 5.76,12.76 4.26,12.76
9V_BEC on Top Layer: 8.76,13.96 11.5,13.96 11.5,12.46 8.76,12.46
9V_BEC on Top Layer: 10.51,14.31 13.56,14.31 13.56,13.41 10.51,13.41
9V_BEC on Inner1: 4.71,15.56 6.86,15.56 6.86,14.56 4.71,14.56
GND on Top Layer: 8.95,22 14.1,22 14.1,20.01 8.95,20.01
GND on Top Layer: 8.95,16.05 14.1,16.05 14.1,14.07 8.95,14.07
GND on Top Layer: 3.81,3.81 33.81,3.81 33.81,33.81 3.81,33.81
GND on Bottom Layer: 3.81,3.81 33.81,3.81 33.81,33.81 3.81,33.81
GND on Inner1: 3.81,3.81 33.81,3.81 33.81,33.81 3.81,33.81
VBAT on Top Layer: 6.88,22.57 7.79,22.57 8.15,22.93 10.03,22.93 10.03,23.39 8.15,23.39 8.05,23.49 6.88,23.49
VBAT on Bottom Layer: 15.61,27.76 12.01,27.76 11.41,28.36 11.41,29.91 13.21,29.91 14.06,29.06 15.61,29.06
VDD_MCU on Top Layer: 16.01,11.46 17.61,11.46 17.61,10.16 16.01,10.16
VDD_MCU on Bottom Layer: 28.86,13.56 31.96,13.56 31.96,13.06 28.86,13.06
VDD_MCU on Bottom Layer: 26.86,16.33 27.81,16.33 27.81,14.51 26.86,14.51
LC_5V on Top Layer: 5.01,25.35 7.21,25.35 7.21,24.25 7.41,24.05 9.91,24.05 10.11,23.85 10.11,23.75 9.91,23.55 5.39,23.55 5.01,23.85
LC_9V on Top Layer: 5.01,19.41 7.21,19.41 7.21,18.31 7.41,18.11 9.91,18.11 10.11,17.91 10.11,17.81 9.91,17.61 5.39,17.61 5.01,17.91

Small or netless copper shapes (teardrops, artwork), in the pictures only: 163 on Top Layer, 115 on Bottom Layer, 40 on Inner1, 21 on Inner2

## Text on the board
Bottom Solder Mask Layer: F405MINI V0.1 | 20241107 Urmouky
Bottom Silkscreen Layer: B-4-3-2-1-N-N-G | T-R-V-G | G-D-C-V | ESC | 9V-G-T-R-G-S | DJI | UART6 | IIC1 | Boot
Top Silkscreen Layer: UART2 | UART4 | UART5 | Camera | VTX | UART1 | R-T-V-G | VO-R3-G-9V | G-V-R-T
